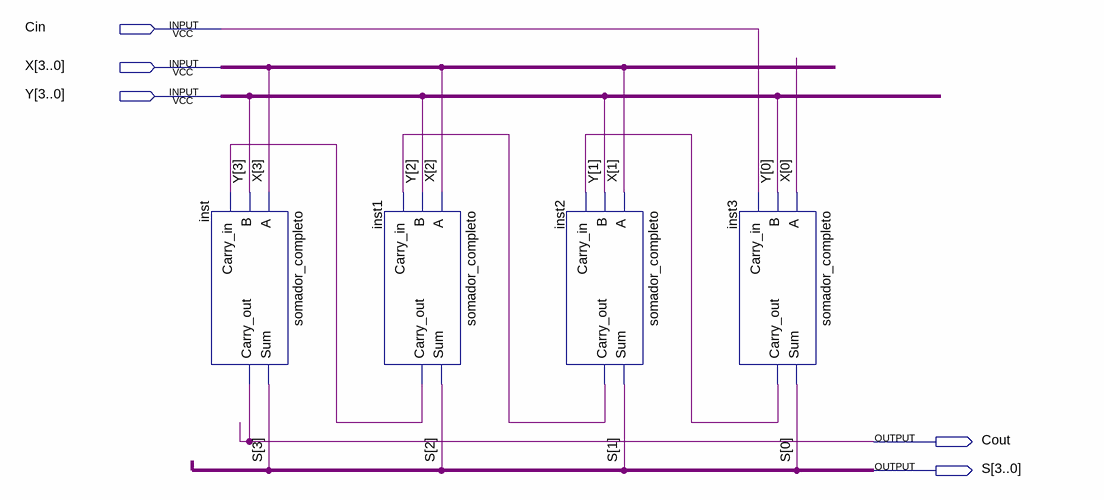
[diagram p0: schematic sheet]
// Quartus schematic somador_4bits.bdf as structural Verilog: 4 symbols, 5 pins
module somador_4bits (
  input  Cin,
  input  [3:0] X,
  input  [3:0] Y,
  output Cout,
  output [3:0] S
);

  wire inst1_carry_out, inst2_carry_out, inst3_carry_out;

  somador_completo inst (.A(X[3]), .B(Y[3]), .Carry_in(inst1_carry_out), .Sum(S[3]), .Carry_out(Cout));
  somador_completo inst1 (.A(X[2]), .B(Y[2]), .Carry_in(inst2_carry_out), .Sum(S[2]), .Carry_out(inst1_carry_out));
  somador_completo inst2 (.A(X[1]), .B(Y[1]), .Carry_in(inst3_carry_out), .Sum(S[1]), .Carry_out(inst2_carry_out));
  somador_completo inst3 (.A(X[0]), .B(Y[0]), .Carry_in(Cin), .Sum(S[0]), .Carry_out(inst3_carry_out));
endmodule
